# Altium schematic sheet Overview.SchDoc
size 416 x 292 mm; DocumentNumber: 1; SheetNumber: 1; SheetTotal: 3
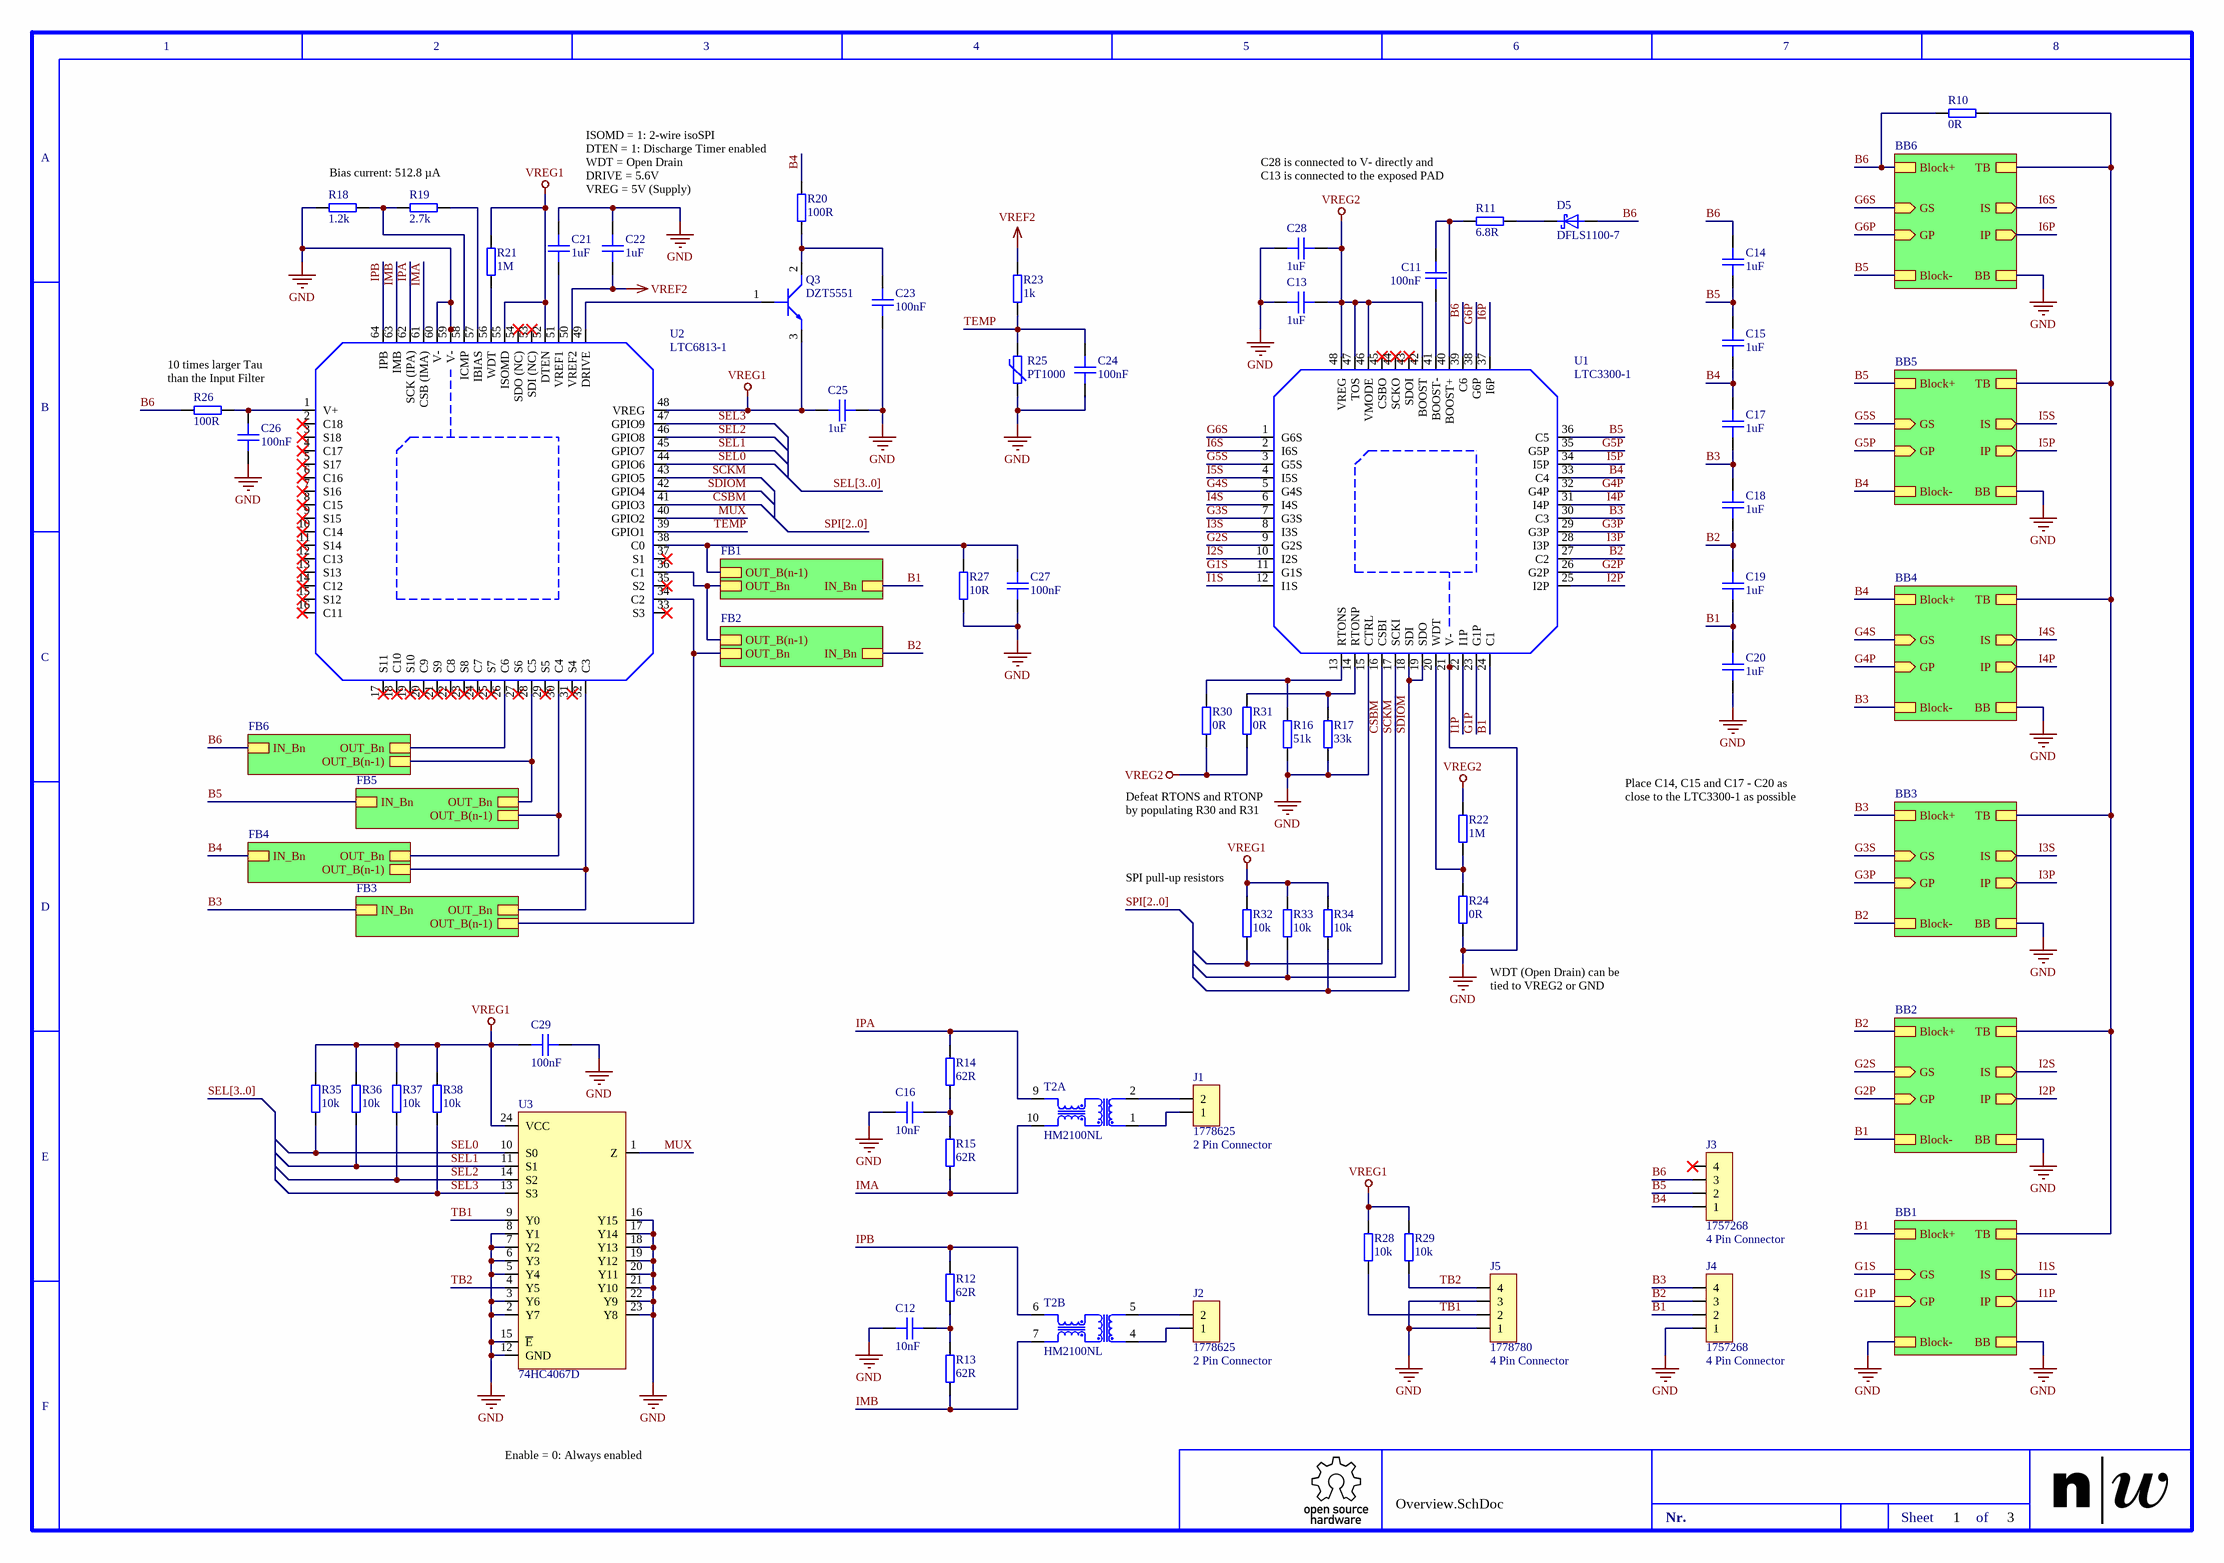
[diagram p0: Overview.SchDoc]

## Parts
C11  100nF  [CAP 0603]
C12  10nF  [CAP 0603]
C13  1uF  [CAP 0603]
C14  1uF  [CAP 0603]
C15  1uF  [CAP 0603]
C16  10nF  [CAP 0603]
C17  1uF  [CAP 0603]
C18  1uF  [CAP 0603]
C19  1uF  [CAP 0603]
C20  1uF  [CAP 0603]
C21  1uF  [CAP 0603]
C22  1uF  [CAP 0603]
C23  100nF  [CAP 0603]
C24  100nF  [CAP 0603]
C25  1uF  [CAP 0603]
C26  100nF  [CAP 0603]
C27  100nF  [CAP 0603]
C28  1uF  [CAP 0603]
C29  100nF  [CAP 0603]
D5  DFLS1100-7  [PowerDI-123]
J1  1778625  [PTSM 0.5 2 HH THT]
J2  1778625  [PTSM 0.5 2 HH THT]
J3  1757268  [MSTBA 2.5 4 G THT 5.08]
J4  1757268  [MSTBA 2.5 4 G THT 5.08]
J5  1778780  [PTSM 0.5 4 HH THT]
Q3  DZT5551  [SOT-223]
R10  0R  [1206]
R11  6.8R  [0603]
R12  62R  [0603]
R13  62R  [0603]
R14  62R  [0603]
R15  62R  [0603]
R16  51k  [0603]
R17  33k  [0603]
R18  1.2k  [0603]
R19  2.7k  [0603]
R20  100R  [0603]
R21  1M  [0603]
R22  1M  [0603]
R23  1k  [0603]
R24  0R  [0603]
R25  PT1000  [1206]
R26  100R  [0603]
R27  10R  [0603]
R28  10k  [0603]
R29  10k  [0603]
R30  0R  [0603]
R31  0R  [0603]
R32  10k  [0603]
R33  10k  [0603]
R34  10k  [0603]
R35  10k  [0603]
R36  10k  [0603]
R37  10k  [0603]
R38  10k  [0603]
T2  HM2100NL  [HM2100NL]  (parts A,B of 2)
U1  LTC3300-1  [eLQFP-48]
U2  LTC6813-1  [eLQFP-64]
U3  74HC4067D  [SO-24]

## Sub-sheets
BB1 = Balancing.SchDoc: GP (in), GS (in), BB, IS (out), Block-, TB, Block+, IP (out)
BB2 = Balancing.SchDoc: GP (in), GS (in), BB, IS (out), Block-, TB, Block+, IP (out)
BB3 = Balancing.SchDoc: GP (in), GS (in), BB, IS (out), Block-, TB, Block+, IP (out)
BB4 = Balancing.SchDoc: GP (in), GS (in), BB, IS (out), Block-, TB, Block+, IP (out)
BB5 = Balancing.SchDoc: GP (in), GS (in), BB, IS (out), Block-, TB, Block+, IP (out)
BB6 = Balancing.SchDoc: GP (in), GS (in), BB, IS (out), Block-, TB, Block+, IP (out)
FB1 = Filter.SchDoc: IN_Bn, OUT_B(n-1), OUT_Bn
FB2 = Filter.SchDoc: IN_Bn, OUT_B(n-1), OUT_Bn
FB3 = Filter.SchDoc: IN_Bn, OUT_B(n-1), OUT_Bn
FB4 = Filter.SchDoc: IN_Bn, OUT_B(n-1), OUT_Bn
FB5 = Filter.SchDoc: IN_Bn, OUT_B(n-1), OUT_Bn
FB6 = Filter.SchDoc: IN_Bn, OUT_B(n-1), OUT_Bn

## Nets
GND: C12.1 C13.2 C16.1 C20.1 C21.2 C22.1 C23.1 C24.1 C25.1 C26.1 C27.1 C28.1 C29.1 J4.1 J5.1 J5.3 R16.1 R17.1 R18.2 R24.1 R25.2 R27.1 U1.15(CTRL) U1.21(V-) U1.49(V-) U2.59(V-) U2.60(V-) U2.65(V-) U3.2(Y7) U3.3(Y6) U3.5(Y4) U3.6(Y3) U3.7(Y2) U3.8(Y1) U3.12(GND) U3.15(~{E}) U3.16(Y15) U3.17(Y14) U3.18(Y13) U3.19(Y12) U3.20(Y11) U3.21(Y10) U3.22(Y9) U3.23(Y8) ; sheet BB1/BB, sheet BB1/Block-, sheet BB2/BB, sheet BB3/BB, sheet BB4/BB, sheet BB5/BB, sheet BB6/BB
VREF2: C22.2 R23.2 U2.50(VREF2)
VREG1: C25.2 C29.2 Q3.3(S) R21.2 R28.2 R29.2 R32.2 R33.2 R34.2 R35.2 R36.2 R37.2 R38.2 U2.48(VREG) U2.52(DTEN) U2.55(ISOMD) U3.24(VCC)
VREG2: C13.1 C28.2 R22.2 R30.1 R31.1 U1.42(BOOST) U1.46(VMODE) U1.47(TOS) U1.48(VREG)
B1: C19.1 C20.2 J4.2 U1.24(C1) ; sheet BB1/Block+, sheet BB2/Block-, sheet FB1/IN_Bn
B2: C18.1 C19.2 J4.3 U1.27(C2) ; sheet BB2/Block+, sheet BB3/Block-, sheet FB2/IN_Bn
B3: C17.1 C18.2 J4.4 U1.30(C3) ; sheet BB3/Block+, sheet BB4/Block-, sheet FB3/IN_Bn
B4: C15.1 C17.2 J3.1 R20.2 U1.33(C4) ; sheet BB4/Block+, sheet BB5/Block-, sheet FB4/IN_Bn
B5: C14.1 C15.2 J3.2 U1.36(C5) ; sheet BB5/Block+, sheet BB6/Block-, sheet FB5/IN_Bn
B6: C14.2 D5.1 J3.3 R10.1 R26.1 U1.39(C6) ; sheet FB6/IN_Bn, sheet BB6/Block+
CSBM: R32.1 U1.16(CSBI) U2.41(GPIO3)
G1P: U1.23(G1P) ; sheet BB1/GP
G1S: U1.11(G1S) ; sheet BB1/GS
G2P: U1.26(G2P) ; sheet BB2/GP
G2S: U1.9(G2S) ; sheet BB2/GS
G3P: U1.29(G3P) ; sheet BB3/GP
G3S: U1.7(G3S) ; sheet BB3/GS
G4P: U1.32(G4P) ; sheet BB4/GP
G4S: U1.5(G4S) ; sheet BB4/GS
G5P: U1.35(G5P) ; sheet BB5/GP
G5S: U1.3(G5S) ; sheet BB5/GS
G6P: U1.38(G6P) ; sheet BB6/GP
G6S: U1.1(G6S) ; sheet BB6/GS
I1P: U1.22(I1P) ; sheet BB1/IP
I1S: U1.12(I1S) ; sheet BB1/IS
I2P: U1.25(I2P) ; sheet BB2/IP
I2S: U1.10(I2S) ; sheet BB2/IS
I3P: U1.28(I3P) ; sheet BB3/IP
I3S: U1.8(I3S) ; sheet BB3/IS
I4P: U1.31(I4P) ; sheet BB4/IP
I4S: U1.6(I4S) ; sheet BB4/IS
I5P: U1.34(I5P) ; sheet BB5/IP
I5S: U1.4(I5S) ; sheet BB5/IS
I6P: U1.37(I6P) ; sheet BB6/IP
I6S: U1.2(I6S) ; sheet BB6/IS
IMA: R15.2 T2.10 U2.61(CSB_(IMA))
IMB: R13.2 T2.7 U2.63(IMB)
IPA: R14.1 T2.9 U2.62(SCK_(IPA))
IPB: R12.1 T2.6 U2.64(IPB)
MUX: U2.40(GPIO2) U3.1(Z)
SCKM: R33.1 U1.17(SCKI) U2.43(GPIO5)
SDIOM: R34.1 U1.18(SDI) U1.19(SDO) U2.42(GPIO4)
SEL0: R35.1 U2.44(GPIO6) U3.10(S0)
SEL1: R36.1 U2.45(GPIO7) U3.11(S1)
SEL2: R37.1 U2.46(GPIO8) U3.14(S2)
SEL3: R38.1 U2.47(GPIO9) U3.13(S3)
TB1: J5.2 R28.1 U3.9(Y0)
TB2: J5.4 R29.1 U3.4(Y5)
TEMP: C24.2 R23.1 R25.1 U2.39(GPIO1)
NetC11_1: C11.1 U1.41(BOOST-)
NetC11_2: C11.2 R11.1 U1.40(BOOST+)
NetC12_2: C12.2 R12.2 R13.1
NetC16_2: C16.2 R14.2 R15.1
NetC21_1: C21.1 U2.51(VREF1)
NetC23_2: C23.2 Q3.2(D) R20.1
NetC26_2: C26.2 R26.2 U2.1(V+)
NetC27_2: C27.2 R27.2 U2.38(C0) ; sheet FB1/OUT_B(n-1)
NetD5_2: D5.2 R11.2
NetJ1_1: J1.1 T2.1
NetJ1_2: J1.2 T2.2
NetJ2_1: J2.1 T2.4
NetJ2_2: J2.2 T2.5
NetQ3_1: Q3.1(G) U2.49(DRIVE)
NetR10_2: R10.2 ; sheet BB1/TB, sheet BB2/TB, sheet BB3/TB, sheet BB4/TB, sheet BB5/TB, sheet BB6/TB
NetR16_2: R16.2 R30.2 U1.13(RTONS)
NetR17_2: R17.2 R31.2 U1.14(RTONP)
NetR18_1: R18.1 R19.2 U2.58(ICMP)
NetR19_1: R19.1 U2.57(IBIAS)
NetR21_1: R21.1 U2.56(WDT)
NetR22_1: R22.1 R24.2 U1.20(WDT)
NetU2_26: U2.26(C6) ; sheet FB6/OUT_Bn
NetU2_28: U2.28(C5) ; sheet FB6/OUT_B(n-1), sheet FB5/OUT_Bn
NetU2_30: U2.30(C4) ; sheet FB5/OUT_B(n-1), sheet FB4/OUT_Bn
NetU2_32: U2.32(C3) ; sheet FB4/OUT_B(n-1), sheet FB3/OUT_Bn
NetU2_34: U2.34(C2) ; sheet FB3/OUT_B(n-1), sheet FB2/OUT_Bn
NetU2_36: U2.36(C1) ; sheet FB2/OUT_B(n-1), sheet FB1/OUT_Bn

Not connected (* = marked no-connect by the designer): J3 4*; U1 43(SDOI)* 44(SCKO)* 45(CSBO)*; U2 2(C18)* 3(S18)* 4(C17)* 5(S17)* 6(C16)* 7(S16)* 8(C15)* 9(S15)* 10(C14)* 11(S14)* 12(C13)* 13(S13)* 14(C12)* 15(S12)* 16(C11)* 17(S11)* 18(C10)* 19(S10)* 20(C9)* 21(S9)* 22(C8)* 23(S8)* 24(C7)* 25(S7)* 27(S6)* 29(S5)* 31(S4)* 33(S3)* 35(S2)* 37(S1)* 53(SDI_(NC))* 54(SDO_(NC))*

## Buses and harness runs
bus SEL[3..0]
bus SPI[2..0]

## Notes on the sheet
- Bias current: 512.8 µA
- ISOMD = 1: 2-wire isoSPI
  DTEN = 1: Discharge Timer enabled
  WDT = Open Drain
  DRIVE = 5.6V
  VREG = 5V (Supply)
- C28 is connected to V- directly and
  C13 is connected to the exposed PAD
- 10 times larger Tau
  than the Input Filter
- Defeat RTONS and RTONP
  by populating R30 and R31
- Place C14, C15 and C17 - C20 as
  close to the LTC3300-1 as possible
- (near R32) SPI pull-up resistors
- (near R24) WDT (Open Drain) can be
  tied to VREG2 or GND
- Enable = 0: Always enabled
- 1
- 2
- 3
- 4
- 5
- 6
- 7
- 8
- A
- B
- C
- D
- E
- F
- Nr.
- Sheet
- of

## Library data of the parts
C11 C23 C24 C26 C27 C29 = 5: ID: 5; Value: 100nF; Mounting: SMT; Package: 0603
C12 C16 = 4: ID: 4; Value: 10nF; Mounting: SMT; Package: 0603
C13-C15 C17-C22 C25 C28 = 8: ID: 8; Tolerance: 20%; Voltage: 16V; Dielectric: X7R; Value: 1uF; Mounting: SMT; Package: 0603; Supplier 1: Digi-Key; Supplier Part Number 1: 1276-6524-1-ND
D5 = 2: ID: 2; Supplier 1: Digi-Key; Supplier Part Number 1: DFLS1100DICT-ND; ComponentLink1Description: Datasheet; ComponentLink1URL: https://www.diodes.com/assets/Datasheets/ds30497.pdf; Designation: DFLS1100-7
J1 J2 = 3: 2 Pin Connector; ID: 3; Desc: 2 Pin Connector; Supplier 1: Distrelec; Supplier Part Number 1: 148-41-887; Designation: 1778625
J3 J4 = 5: 4 Pin Connector; ID: 5; Descr: 4 Pin Connector; Supplier 1: Distrelec; Supplier Part Number 1: 301-07-680; Designation: 1757268
J5 = 4: 4 Pin Connector; ID: 4; Descr: 4 Pin Connector; Supplier 1: Distrelec; Supplier Part Number 1: 148-41-896; Designation: 1778780
Q3 = 1: ID: 1; Supplier 1: Digi-Key; Supplier Part Number 1: DZT5551DICT-ND; ComponentLink1Description: Datasheet; ComponentLink1URL: https://www.diodes.com/assets/Datasheets/ds31219.pdf; Designation: DZT5551
R10 = 580: ID: 580; Tolerance: 1%; Power Rating: 0.25W; Value: 0R; Mounting: SMD; Type: Chip; Package: 1206
R11 = 215: ID: 215; Tolerance: 1%; Power Rating: 0.1W; Value: 6.8R; Mounting: SMD; Type: Chip; Package: 0603
R12-R15 = 238: ID: 238; Tolerance: 1%; Power Rating: 0.1W; Value: 62R; Mounting: SMD; Type: Chip; Package: 0603
R16 = 308: ID: 308; Tolerance: 1%; Power Rating: 0.1W; Value: 51k; Mounting: SMD; Type: Chip; Package: 0603
R17 = 303: ID: 303; Tolerance: 1%; Power Rating: 0.1W; Value: 33k; Mounting: SMD; Type: Chip; Package: 0603
R18 = 269: ID: 269; Tolerance: 1%; Power Rating: 0.1W; Value: 1.2k; Mounting: SMD; Type: Chip; Package: 0603
R19 = 277: ID: 277; Tolerance: 1%; Power Rating: 0.1W; Value: 2.7k; Mounting: SMD; Type: Chip; Package: 0603
R20 R26 = 243: ID: 243; Tolerance: 1%; Power Rating: 0.1W; Value: 100R; Mounting: SMD; Type: Chip; Package: 0603
R21 R22 = 339: ID: 339; Tolerance: 1%; Power Rating: 0.1W; Value: 1M; Mounting: SMD; Type: Chip; Package: 0603
R23 = 267: ID: 267; Tolerance: 1%; Power Rating: 0.1W; Value: 1k; Mounting: SMD; Type: Chip; Package: 0603
R24 R30 R31 = 194: ID: 194; Tolerance: 1%; Power Rating: 0.1W; Value: 0R; Mounting: SMD; Type: Chip; Package: 0603
R25 = 1: ID: 1; Device Height: 0.55mm; Designation: PTS120601B1K00P100; Value: PT1000; Mounting: SMT; Package: 1206; Supplier 1: Digi-Key; Supplier Part Number 1: PTS12061.0KCT-ND; ComponentLink1Description: Datasheet; ComponentLink1URL: https://www.vishay.com/docs/28762/ptsserie.pdf
R27 = 219: ID: 219; Tolerance: 1%; Power Rating: 0.1W; Value: 10R; Mounting: SMD; Type: Chip; Package: 0603
R28 R29 R32-R38 = 291: ID: 291; Tolerance: 1%; Power Rating: 0.1W; Value: 10k; Mounting: SMD; Type: Chip; Package: 0603
T2 = 3: BMS Communication Transformer with Choke; ID: 3; Turns Ratio: 1:1; Insulation: 4.3kV; Primary Inductance: 300uH; Tolerance: 50%; DCR Primary: 850m; DCR Secondary: 450m; Device Height: 3.45mm; Mounting: SMT; Supplier 1: Digi-Key; Supplier Part Number 1: 1840-1032-1-ND; ComponentLink1Description: Datasheet; ComponentLink1URL: https://productfinder.pulseeng.com/doc_type/WEB301/doc_num/HM2100NL/doc_part/HM2100NL.pdf; Designation: HM2100NL
U1 = 2: Battery Balancer; ID: 2; Mounting: SMT; Package: eLQFP-48; Supplier 1: Digi-Key; Supplier Part Number 1: LTC3300ILXE-1#PBF-ND; ComponentLink1Description: Datasheet; ComponentLink1URL: https://www.analog.com/media/en/technical-documentation/data-sheets/33001fb.pdf; Designation: LTC3300-1
U2 = 1: Battery Monitor; ID: 1; Mounting: SMT; Package: eLQFP-64; Supplier 1: Digi-Key; Supplier Part Number 1: LTC6813ILWE-1#3ZZPBF-ND; ComponentLink1Description: Datasheet; ComponentLink1URL: https://www.analog.com/media/en/technical-documentation/data-sheets/68131f.pdf; Designation: LTC6813-1
U3 = 1: MUX 16:1; ID: 1; Mounting: SMT; Package: SO-24; Supplier 1: Digi-Key; Supplier Part Number 1: 1727-6334-1-ND; ComponentLink1Description: Datasheet; ComponentLink1URL: https://www.analog.com/media/en/technical-documentation/data-sheets/6820fb.pdf; Designation: 74HC4067D